# Altium schematic sheet ConnectorTranslator.SchDoc: Connector and Level Translators
size Letter; DrawnBy: AdamGilbert; Engineer: AdamGilbert; Revision: Rev0
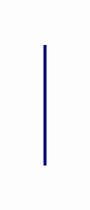
[diagram p0: ConnectorTranslator.SchDoc]

## Notes on the sheet
- File:
- Size:
- Date:
- Letter
- Revision:
- Sheet
- of
- Cosmology
- Drawn by: